# EAGLE design Placa_PCB_Robot_CAOS (EAGLE 9.7.0)
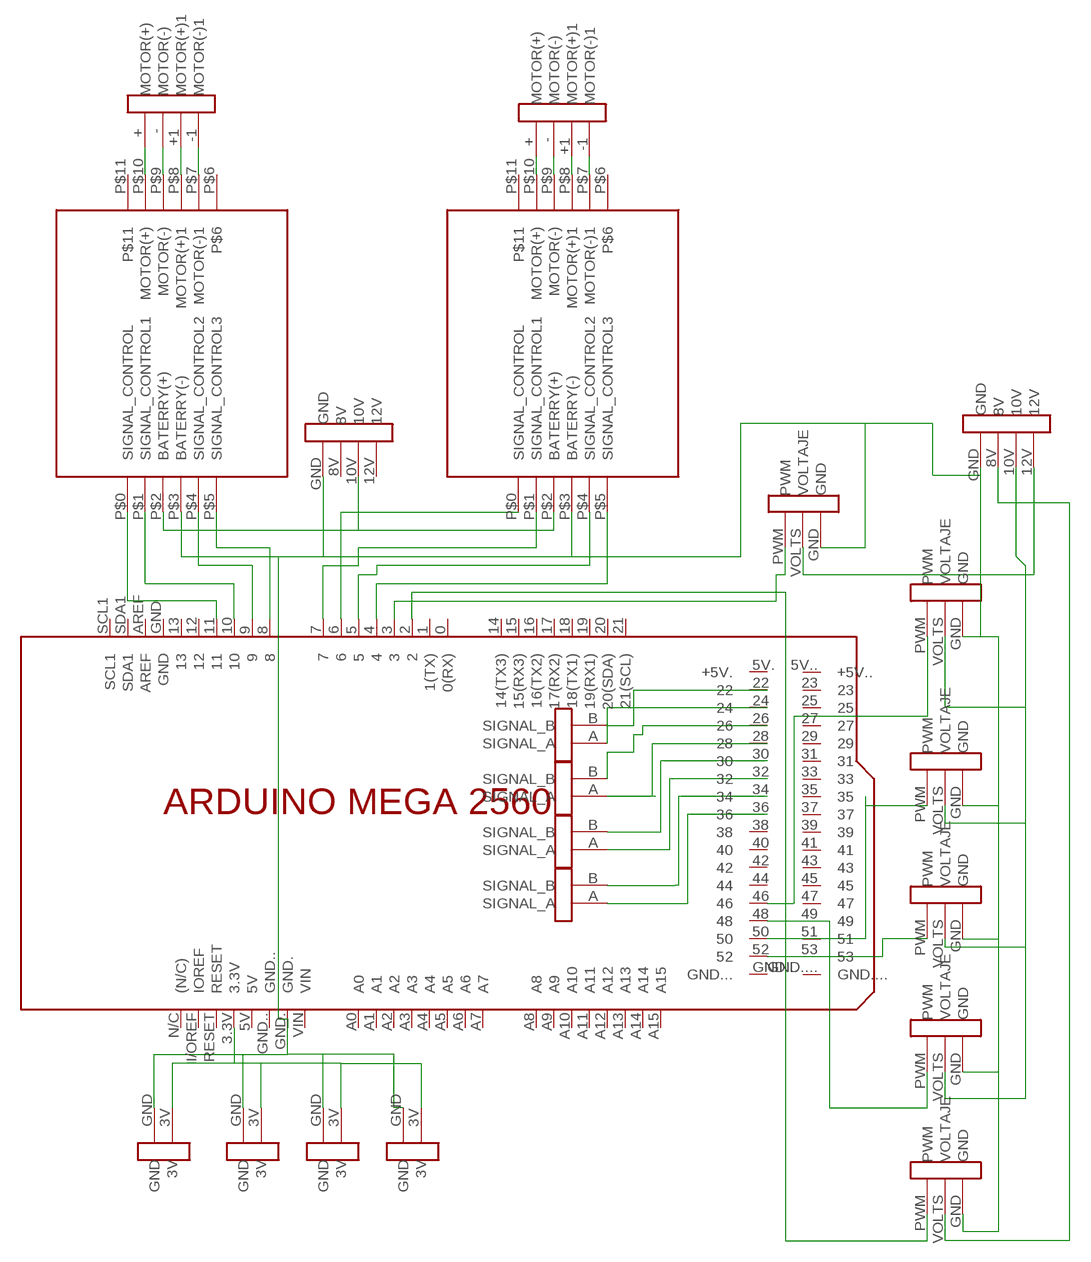
[diagram p0: schematic, sheet 1]

## Parts
INTENTO1  DRV8833DRV8833  [DRV8833]
INTENTO2  DRV8833DRV8833  [DRV8833]
PCB1  ARDUINO_MEGA2560  [ARDUINO_MEGA2560]
U$1  MOTOR_CD  [MOTOR_CD]
U$2  MOTOR_CD  [MOTOR_CD]
U$3  BATTERY  [BATTERY]
U$4  SERVO_MOTORES  [SERVO_MOTOR]
U$5  SERVO_MOTORES  [SERVO_MOTOR]
U$6  SERVO_MOTORES  [SERVO_MOTOR]
U$7  SERVO_MOTORES  [SERVO_MOTOR]
U$8  SERVO_MOTORES  [SERVO_MOTOR]
U$9  SERVO_MOTORES  [SERVO_MOTOR]
U$10  BATTERY  [BATTERY]
U$11  ENCODER_VOLTAJE  [ENCODER_VOLTAJE]
U$12  ENCODER_VOLTAJE  [ENCODER_VOLTAJE]
U$13  ENCODER_VOLTAJE  [ENCODER_VOLTAJE]
U$14  ENCODER_VOLTAJE  [ENCODER_VOLTAJE]
U$15  SIGNAL_ENCODER2  [SIGNAL_ENCODER]
U$16  SIGNAL_ENCODER2  [SIGNAL_ENCODER]
U$17  SIGNAL_ENCODER2  [SIGNAL_ENCODER]
U$18  SIGNAL_ENCODER2  [SIGNAL_ENCODER]

## Nets
GND: INTENTO1.P$3(BATERRY(-)) INTENTO2.P$3(BATERRY(-)) PCB1.GND. U$3.GND U$4.GND U$5.GND U$6.GND U$7.GND U$8.GND U$9.GND U$10.GND U$11.GND U$12.GND U$13.GND U$14.GND
N$1: INTENTO1.P$10(MOTOR(+)) U$1.+(MOTOR(+))
N$2: INTENTO1.P$9(MOTOR(-)) U$1.-(MOTOR(-))
N$3: INTENTO1.P$8(MOTOR(+)1) U$1.+1(MOTOR(+)1)
N$4: U$9.VOLTS(VOLTAJE) U$10.8V
N$5: INTENTO1.P$7(MOTOR(-)1) U$1.-1(MOTOR(-)1)
N$6: INTENTO1.P$0(SIGNAL_CONTROL) PCB1.11
N$7: INTENTO1.P$1(SIGNAL_CONTROL1) PCB1.10
N$8: INTENTO2.P$10(MOTOR(+)) U$2.+(MOTOR(+))
N$9: INTENTO1.P$4(SIGNAL_CONTROL2) PCB1.9
N$10: INTENTO1.P$5(SIGNAL_CONTROL3) PCB1.8
N$11: INTENTO2.P$0(SIGNAL_CONTROL) PCB1.6
N$12: PCB1.24 U$15.A(SIGNAL_A)
N$13: INTENTO2.P$4(SIGNAL_CONTROL2) PCB1.5
N$14: INTENTO2.P$5(SIGNAL_CONTROL3) PCB1.4
N$15: INTENTO2.P$9(MOTOR(-)) U$2.-(MOTOR(-))
N$16: INTENTO2.P$8(MOTOR(+)1) U$2.+1(MOTOR(+)1)
N$17: INTENTO2.P$7(MOTOR(-)1) U$2.-1(MOTOR(-)1)
N$18: INTENTO1.P$2(BATERRY(+)) INTENTO2.P$2(BATERRY(+)) U$3.10V
N$19: PCB1.3 U$4.PWM
N$20: U$4.VOLTS(VOLTAJE) U$10.12V
N$21: PCB1.50 U$6.PWM
N$22: PCB1.52 U$7.PWM
N$23: PCB1.48 U$8.PWM
N$24: INTENTO2.P$1(SIGNAL_CONTROL1) PCB1.7
N$25: PCB1.46 U$5.PWM
N$26: U$5.VOLTS(VOLTAJE) U$6.VOLTS(VOLTAJE) U$7.VOLTS(VOLTAJE) U$8.VOLTS(VOLTAJE) U$10.10V
N$27: PCB1.3.3V U$11.3V U$12.3V U$13.3V U$14.3V
N$28: PCB1.22 U$15.B(SIGNAL_B)
N$30: PCB1.26 U$16.B(SIGNAL_B)
N$31: PCB1.34 U$18.B(SIGNAL_B)
N$33: PCB1.30 U$17.B(SIGNAL_B)
N$34: PCB1.32 U$17.A(SIGNAL_A)
N$36: PCB1.36 U$18.A(SIGNAL_A)
N$37: PCB1.2 U$9.PWM
N$38: PCB1.28 U$16.A(SIGNAL_A)
Unconnected: INTENTO1.P$6 INTENTO1.P$11 INTENTO2.P$6 INTENTO2.P$11 PCB1.0(0(RX)) PCB1.1(1(TX)) PCB1.5V PCB1.5V.(+5V.) PCB1.5V..(+5V..) PCB1.12 PCB1.13 PCB1.14(14(TX3)) PCB1.15(15(RX3)) PCB1.16(16(TX2)) PCB1.17(17(RX2)) PCB1.18(18(TX1)) PCB1.19(19(RX1)) PCB1.20(20(SDA)) PCB1.21(21(SCL)) PCB1.23 PCB1.25 PCB1.27 PCB1.29 PCB1.31 PCB1.33 PCB1.35 PCB1.37 PCB1.38 PCB1.39 PCB1.40 PCB1.41 PCB1.42 PCB1.43 PCB1.44 PCB1.45 PCB1.47 PCB1.49 PCB1.51 PCB1.53 PCB1.A0 PCB1.A1 PCB1.A2 PCB1.A3 PCB1.A4 PCB1.A5 PCB1.A6 PCB1.A7 PCB1.A8 PCB1.A9 PCB1.A10 PCB1.A11 PCB1.A12 PCB1.A13 PCB1.A14 PCB1.A15 PCB1.AREF PCB1.GND PCB1.GND.. PCB1.GND... PCB1.GND.... PCB1.I/OREF(IOREF) PCB1.N/C((N/C)) PCB1.RESET PCB1.SCL1 PCB1.SDA1 PCB1.VIN U$3.8V U$3.12V

## Library data of the parts
INTENTO1 INTENTO2 = Biblioteca:DRV8833
PCB1 = E14_Arduino_revC:ARDUINO_MEGA2560: Device for representing an Arduino Mega 2560 board with a footprint in an EAGLE design. Created by Dave Young for Element14. More EAGLE documentation at: http://www.element14.com/community/community/knode/cadsoft_eagle
U$1 U$2 = JST:MOTOR_CD
U$3 U$10 = JST:BATTERY
U$4-U$9 = JST:SERVO_MOTORES
U$11-U$14 = JST:ENCODER_VOLTAJE
U$15-U$18 = JST:SIGNAL_ENCODER

## Board
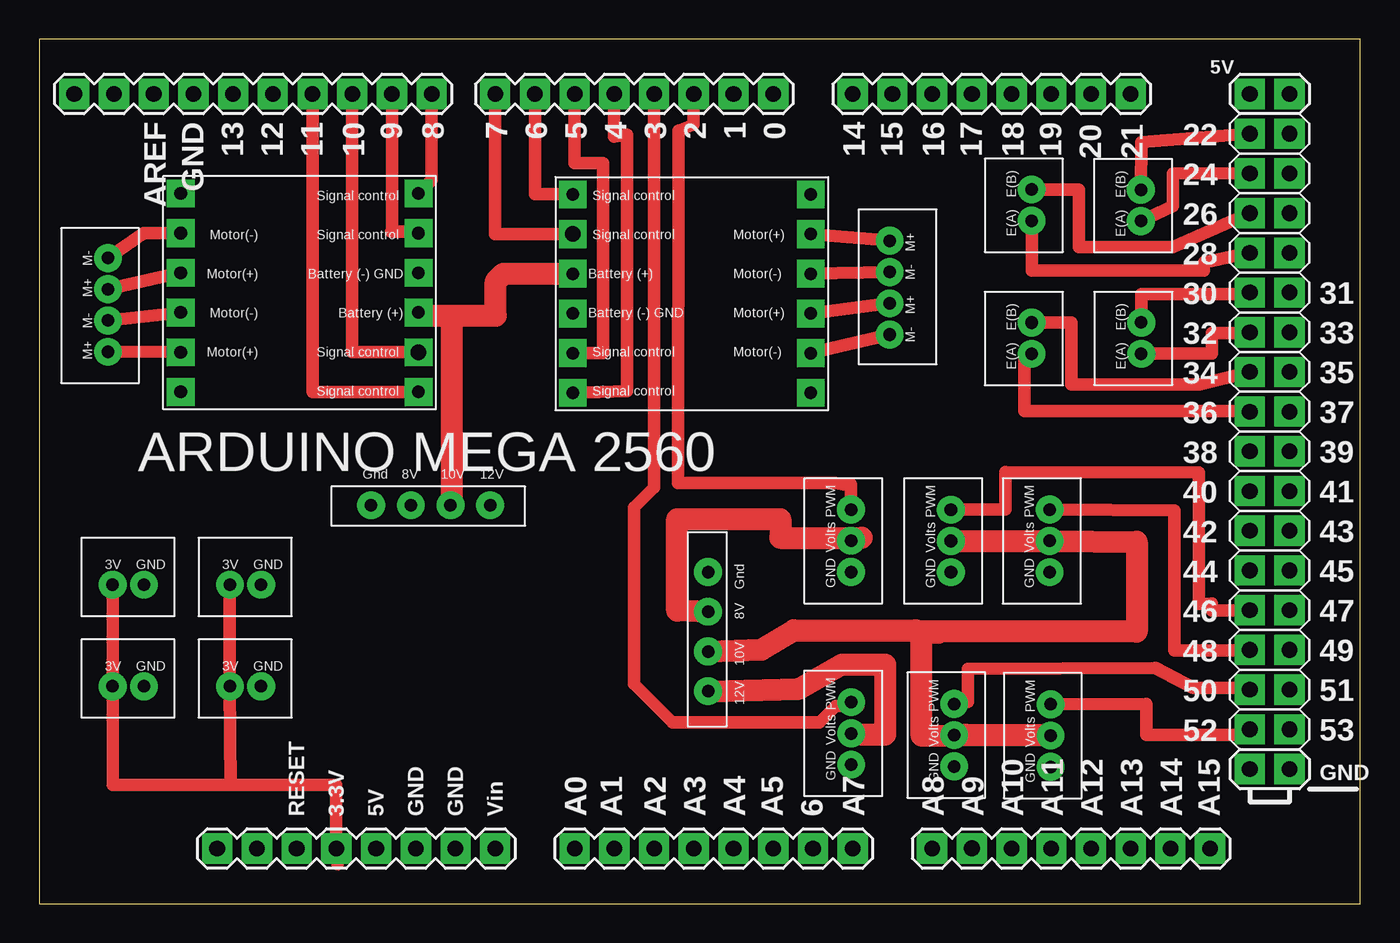
[diagram p1: board, top side]
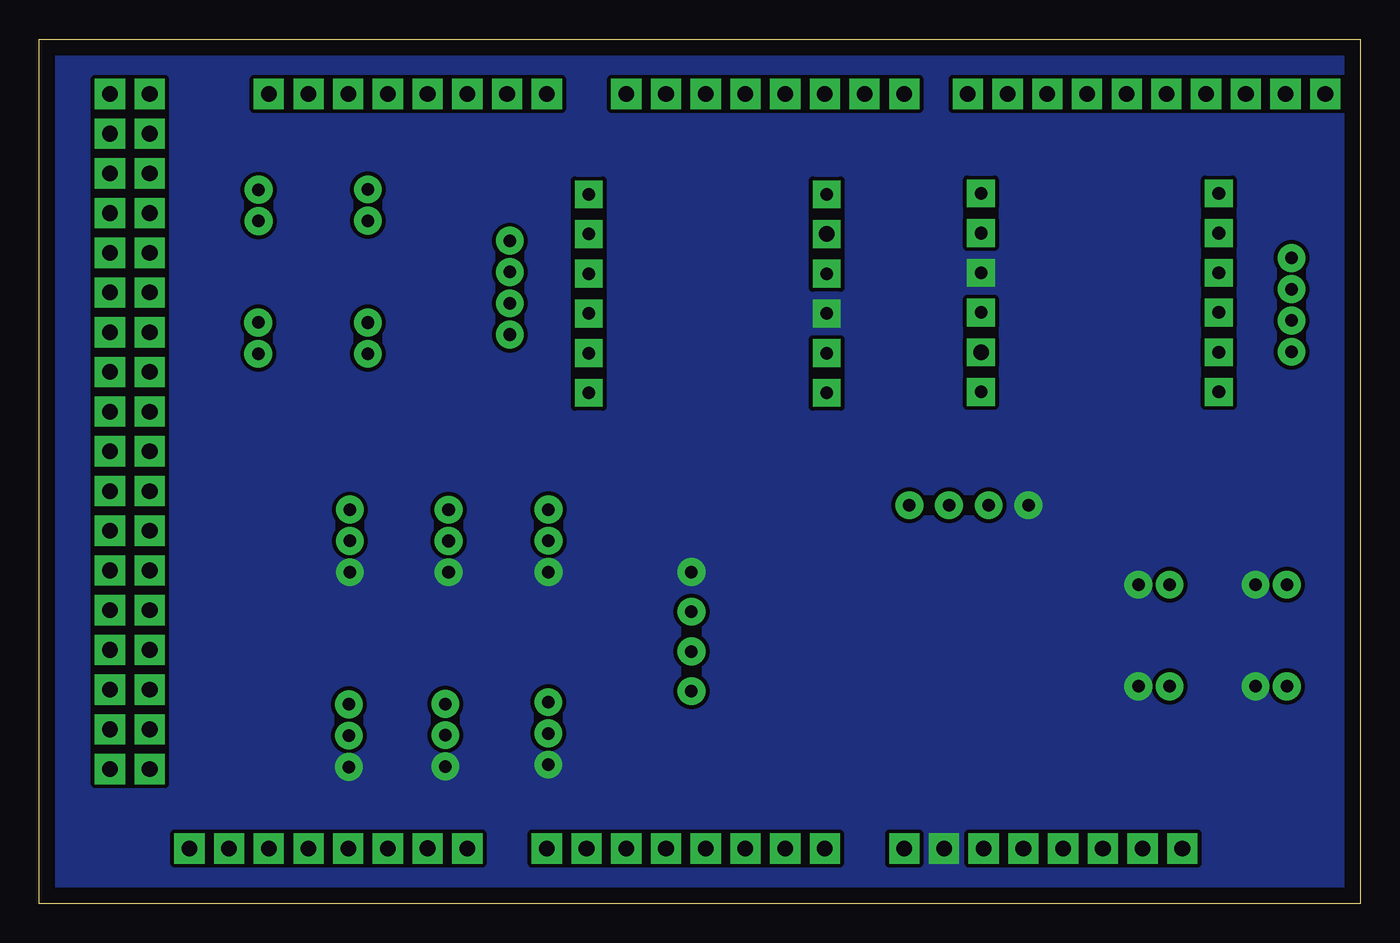
[diagram p2: board, bottom side, seen from below]

Size 84.5 x 55.3 mm. Coordinates in mm from the lower left corner, seen from the top.
Outline: 0,0 84.5,0 84.5,55.3 0,55.3 0,0
Copper layers (1*16): Top 0.035mm / dielectric 1.5mm / Bottom 0.035mm
Design rules "Fusion Electronics Design Rules": minimum track width 0.8mm, minimum drill 24mil, track to track 0.2mm, track to pad 8mil, pad to pad 8mil, via to via 8mil, smd to smd 8mil, copper to edge 40mil, drill to drill 8mil, minimum pad ring 10mil, minimum via ring 8mil, stop-mask expansion 4mil, vias tented up to drill 0mil, thermal gap 10mil

### Footprints (pad centres in the part's own frame; a part is rotated, then mirrored left to right if it is on the bottom)
DRV8833 = drill 0.8 pad 1.778 square: P$0 1.135,13.871; P$2 1.135,8.791; P$3 1.135,6.251; P$4 1.135,3.711; P$5 1.135,1.171; P$6 16.345,1.171; P$7 16.345,3.711; P$8 16.345,6.251; P$9 16.345,8.791; P$10 16.345,11.331; P$11 16.345,13.871 | drill 1 pad 1.778 square: P$1 1.135,11.331
ARDUINO_MEGA2560 = drill 1 pad 1.93 square: 0 63.5,50.8; 1 60.96,50.8; 2 58.42,50.8; 3 55.88,50.8; 3.3V 35.56,2.54; 4 53.34,50.8; 5 50.8,50.8; 5V 38.1,2.54; 5V. 93.98,50.8; 5V.. 96.52,50.8; 6 48.26,50.8; 7 45.72,50.8; 8 41.656,50.8; 9 39.116,50.8; 10 36.576,50.8; 11 34.036,50.8; 12 31.496,50.8; 13 28.956,50.8; 14 68.58,50.8; 15 71.12,50.8; 16 73.66,50.8; 17 76.2,50.8; 18 78.74,50.8; 19 81.28,50.8; 20 83.82,50.8; 21 86.36,50.8; 22 93.98,48.26; 23 96.52,48.26; 24 93.98,45.72; 25 96.52,45.72; 26 93.98,43.18; 27 96.52,43.18; 28 93.98,40.64; 29 96.52,40.64; 30 93.98,38.1; 31 96.52,38.1; 32 93.98,35.56; 33 96.52,35.56; 34 93.98,33.02; 35 96.52,33.02; 36 93.98,30.48; 37 96.52,30.48; 38 93.98,27.94; 39 96.52,27.94; 40 93.98,25.4; 41 96.52,25.4; 42 93.98,22.86; 43 96.52,22.86; 44 93.98,20.32; 45 96.52,20.32; 46 93.98,17.78; 47 96.52,17.78; 48 93.98,15.24; 49 96.52,15.24; 50 93.98,12.7; 51 96.52,12.7; 52 93.98,10.16; 53 96.52,10.16; A0 50.8,2.54; A1 53.34,2.54; A2 55.88,2.54; A3 58.42,2.54; A4 60.96,2.54; A5 63.5,2.54; A6 66.04,2.54; A7 68.58,2.54; A8 73.66,2.54; A10 78.74,2.54; A11 81.28,2.54; A12 83.82,2.54; A13 86.36,2.54; A14 88.9,2.54; A15 91.44,2.54; AREF 23.876,50.8; GND 26.416,50.8; GND. 43.18,2.54; GND.. 40.64,2.54; GND... 93.98,7.62; GND.... 96.52,7.62; I/OREF 30.48,2.54; N/C 27.94,2.54; RESET 33.02,2.54; SCL1 18.796,50.8; SDA1 21.336,50.8; VIN 45.72,2.54 | drill 1.016 pad 1.93 square: A9 76.2,2.54
MOTOR_CD = drill 0.8 pad 1.778: + 2,2; +1 6,2; - 4,2; -1 8,2
BATTERY = drill 0.8 pad 1.778: 8V 5.08,1.3; 10V 7.62,1.3; 12V 10.16,1.3; GND 2.54,1.3
SERVO_MOTOR = drill 0.8 pad 1.778: GND 2,2; PWM 6,2; VOLTS 4,2
ENCODER_VOLTAJE = drill 0.8 pad 1.778: 3V 2,2; GND 4,2
SIGNAL_ENCODER = drill 0.8 pad 1.778: A 2,2; B 4,2

### Placement (x,y rotation side)
INTENTO1  25.4,46.6 180 top
INTENTO2  33,31.5 0 top
PCB1  -16.55,0.99 0 top
U$1  6.4,33.3 90 top
U$2  52.4,44.4 270 top
U$3  18.69,24.18 0 top
U$4  53.93,6.89 90 top
U$5  60.31,19.2 90 top
U$6  60.52,6.78 90 top
U$7  66.69,6.75 90 top
U$8  66.63,19.2 90 top
U$9  53.92,19.21 90 top
U$10  41.48,23.75 270 top
U$11  2.7,11.9 0 top
U$12  10.2,11.9 0 top
U$13  2.7,18.4 0 top
U$14  10.2,18.4 0 top
U$15  72.47,41.66 90 top
U$16  65.48,41.68 90 top
U$17  72.48,33.17 90 top
U$18  65.48,33.17 90 top

### Tracks (layer width: path | path; a pad name or v marks a point on that pad's centre or on a via)
GND
  pour Bottom (isolate 0.254, no thermals): 0,0 85,0 85,55 0,55
N$1
  Top 0.813: U$1.+ INTENTO1.P$10
N$2
  Top 0.813: U$1.- INTENTO1.P$9
N$3
  Top 0.813: U$1.+1 INTENTO1.P$8
N$4
  Top 1.422: U$10.8V 40.8,18.75 40.8,24.6 47.4,24.6 47.4,23.4 52.62,23.4 U$9.VOLTS
N$5
  Top 0.813: U$1.-1 6.69,42.89 INTENTO1.P$7
N$6
  Top 0.813: INTENTO1.P$0 17.49,32.73 PCB1.11
N$7
  Top 0.813: INTENTO1.P$1 20.03,35.27 PCB1.10
N$8
  Top 0.813: INTENTO2.P$10 U$2.+
N$9
  Top 0.813: INTENTO1.P$4 24.15,43 22.5,43 22.57,43.07 PCB1.9
N$10
  Top 0.813: INTENTO1.P$5 25.11,46.27 PCB1.8
N$11
  Top 0.813: INTENTO2.P$0 31.71,45.37 PCB1.6
N$12
  Top 0.813: U$15.A 72.5,44.6 72.5,46.7 PCB1.24
N$13
  Top 0.813: INTENTO2.P$4 36.06,35.21 36.06,47.37 34.25,47.37 PCB1.5
N$14
  Top 0.813: PCB1.4 36.76,51.79 36.76,49.07 37.61,49.19 37.61,32.79 INTENTO2.P$5
N$15
  Top 0.813: INTENTO2.P$9 U$2.-
N$16
  Top 0.813: INTENTO2.P$8 U$2.+1
N$17
  Top 0.813: INTENTO2.P$7 U$2.-1
N$18
  Top 1.422: INTENTO2.P$2 29.69,40.29 29.2,39.8 29.2,37.6 26.4,37.6 | INTENTO1.P$2 24.47,37.6 26.4,37.6 | U$3.10V 26.4,25.48 26.4,37.6
N$19
  Top 0.813: PCB1.3 39.32,51.79 39.32,26.61 38.05,25.34 38.05,14.07 40.51,11.61 49.92,11.61 50.95,12.64 52.38,12.64 U$4.PWM
N$20
  Top 1.422: U$10.12V 48.6,13.75 51.35,15.3 54.1,15.3 54.1,10.8 52.63,10.8 U$4.VOLTS
N$21
  Top 0.813: U$6.PWM 59.4,12.91 59.4,15 71.39,15.08 73.8,13.8 77.43,13.8 PCB1.50
N$22
  Top 0.813: 77.43,11.6 PCB1.52 77.43,10.8 70.8,10.8 70.8,12.78 U$7.PWM
N$23
  Top 0.813: U$8.PWM 72.6,25.14 72.6,16.2 77.43,16.2 PCB1.48
N$24
  Top 0.813: PCB1.7 29.15,51.79 29.15,42.83 INTENTO2.P$1
N$25
  Top 0.813: PCB1.46 75,18.77 75,19.2 74.18,19.17 74.18,27.57 61.8,27.6 61.8,25.2 59.26,25.2 U$5.PWM
N$26
  Top 1.422: 56.4,17.4 70.2,17.4 70.2,23.14 U$8.VOLTS U$5.VOLTS | U$10.10V 46.2,16.25 48.26,17.48 56.05,17.48 56.4,17.4 | 56.4,17.4 56.43,17.37 | 56.43,17.37 57.54,17.32 | U$7.VOLTS U$6.VOLTS 59.25,10.8 57.23,10.73 56.43,10.73 56.43,17.37
N$27
  Top 0.813: 19.1,2.53 PCB1.3.3V 19,7.6 12.24,7.6 | 12.24,7.6 4.7,7.6 U$11.3V U$13.3V | U$14.3V U$12.3V 12.24,7.6
N$28
  Top 0.813: U$15.B 70.5,48.7 PCB1.22
N$30
  Top 0.813: U$16.B 66.5,45.68 66.5,42 72.5,42 PCB1.26
N$31
  Top 0.813: U$18.B 66,37.17 66,33.2 74.2,33.2 PCB1.34
N$33
  Top 0.813: U$17.B 70.5,37.17 70.5,39 77.43,39 PCB1.30
N$34
  Top 0.813: U$17.A 75,35.17 75,36.5 77.43,36.5 PCB1.32
N$36
  Top 0.813: U$18.A 63,35.17 63,31.5 77.43,31.5 PCB1.36
N$37
  Top 0.813: 52.2,25.21 U$9.PWM 51.92,26.8 51.47,26.82 50.94,26.9 40.86,26.91 40.88,49.45 41.85,49.83 PCB1.2
N$38
  Top 0.813: 77.43,41.5 PCB1.28 74.5,41 74.5,40.5 63.5,40.5 63.5,43.68 U$16.A